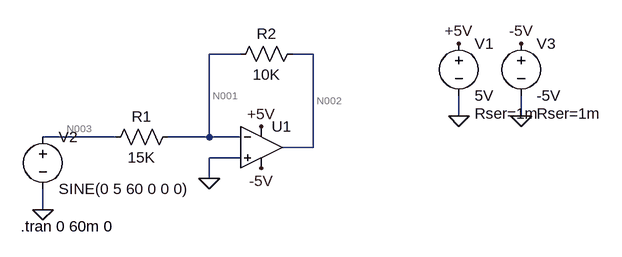
[diagram p0: schematic Draft5.asc]
Draft5.asc, the LTspice schematic file:
Version 4
SHEET 1 880 680
WIRE 160 16 112 16
WIRE 272 16 240 16
WIRE 496 112 496 80
WIRE 592 112 592 80
WIRE -32 144 -144 144
WIRE 112 144 112 16
WIRE 112 144 48 144
WIRE 160 144 112 144
WIRE 272 160 272 16
WIRE 272 160 224 160
WIRE 160 176 112 176
WIRE 112 208 112 176
WIRE -144 256 -144 224
FLAG 112 208 0
FLAG 496 112 0
FLAG 496 0 +5V
FLAG 192 128 +5V
FLAG -144 256 0
FLAG 592 112 0
FLAG 592 0 -5V
FLAG 192 192 -5V
SYMBOL Opamps\\UniversalOpamp2 192 160 R0
SYMATTR InstName U1
SYMBOL res 64 128 R90
WINDOW 0 0 56 VBottom 2
WINDOW 3 32 56 VTop 2
SYMATTR InstName R1
SYMATTR Value 15K
SYMATTR SpiceLine tol=1 pwr=0.1
SYMBOL res 256 0 R90
WINDOW 0 0 56 VBottom 2
WINDOW 3 32 56 VTop 2
SYMATTR InstName R2
SYMATTR Value 10K
SYMATTR SpiceLine tol=1 pwr=0.1
SYMBOL voltage 496 -16 R0
WINDOW 123 0 0 Left 2
WINDOW 39 24 124 Left 2
SYMATTR InstName V1
SYMATTR Value 5V
SYMATTR SpiceLine Rser=1m
SYMBOL voltage -144 128 R0
WINDOW 123 0 0 Left 2
WINDOW 39 0 0 Left 2
SYMATTR InstName V2
SYMATTR Value SINE(0 5 60 0 0 0)
SYMBOL voltage 592 -16 R0
WINDOW 123 0 0 Left 2
WINDOW 39 24 124 Left 2
SYMATTR InstName V3
SYMATTR Value -5V
SYMATTR SpiceLine Rser=1m
TEXT -178 282 Left 2 !.tran 0 60m 0

The netlist it stands for:
* Draft5.asc
XU1 0 N001 +5V -5V N002 level.2 Avol=1Meg GBW=10Meg Slew=10Meg ilimit=25m rail=0 Vos=0 phimargin=45 en=0 enk=0 in=0 ink=0 Rin=500Meg  ; pins IN+ IN- V+ V- OUT
R1 N001 N003 15K tol=1 pwr=0.1
R2 N002 N001 10K tol=1 pwr=0.1
V1 +5V 0 5V Rser=1m
V2 N003 0 SINE(0 5 60 0 0 0)
V3 -5V 0 -5V Rser=1m
.tran 0 60m 0
.lib UniversalOpamps2.sub
.backanno
.end

* Results of the author's LTspice run, read from the files saved beside the schematic
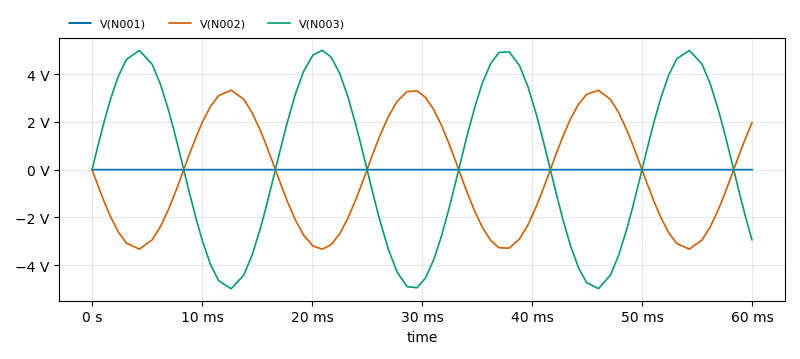
[diagram p1: Transient Analysis of Draft5.asc, plotted from the saved traces]
* Transient Analysis, 1 run:
*   V(N001): min -20.41 µV, max 25.21 µV, average -254.5 nV, rms 14.7 µV, last -18.28 µV
*   V(N002): min -3.33 V, max 3.327 V, average -264.2 mV, rms 2.32 V, last 1.959 V
*   V(N003): min -4.991 V, max 4.996 V, average 396.2 mV, rms 3.48 V, last -2.939 V